# EAGLE design jumper_bed_M (EAGLE 9.6.2)
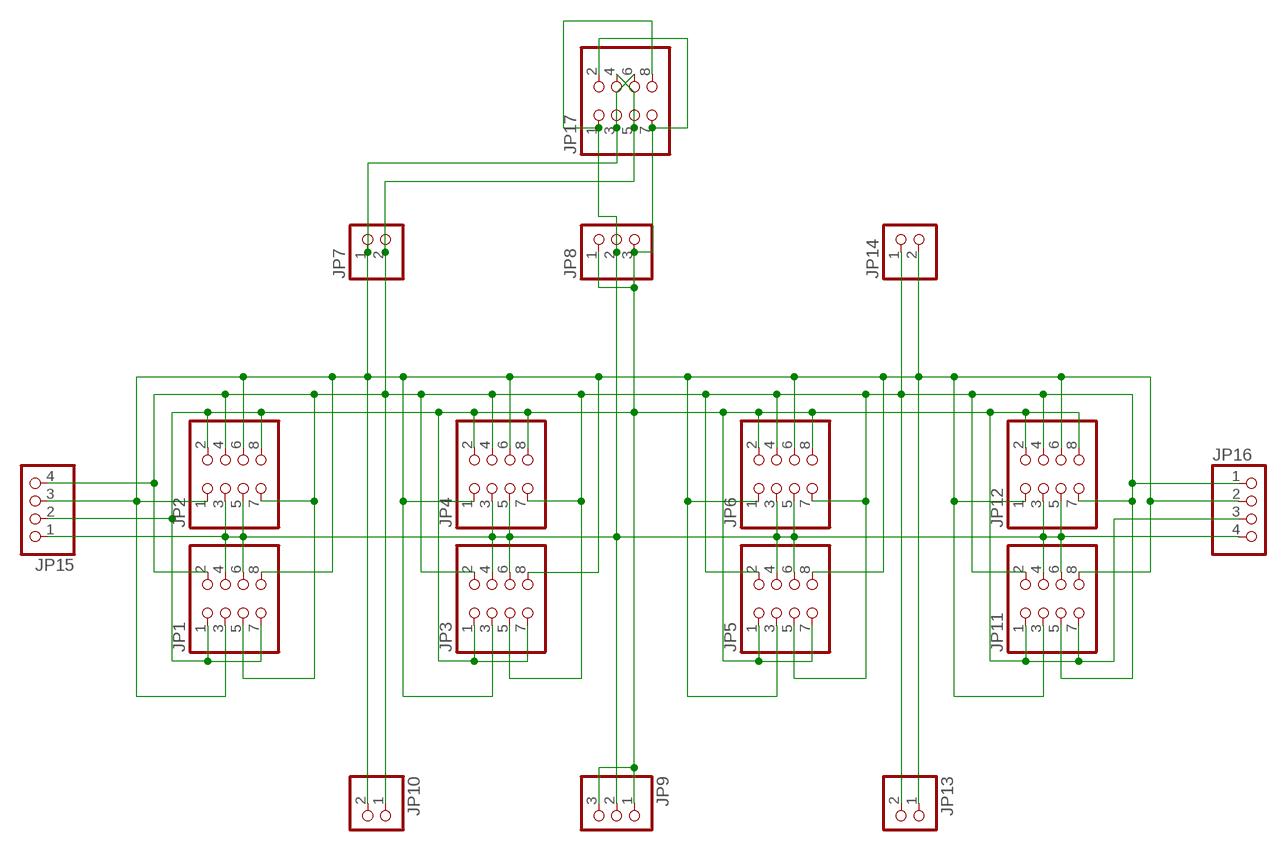
[diagram p0: schematic, sheet 1]

## Parts
JP1  PINHD-2X4  [2X04]
JP2  PINHD-2X4  [2X04]
JP3  PINHD-2X4  [2X04]
JP4  PINHD-2X4  [2X04]
JP5  PINHD-2X4  [2X04]
JP6  PINHD-2X4  [2X04]
JP7  PINHD-1X2/90  [1X02/90]
JP8  PINHD-1X3/90  [1X03/90]
JP9  PINHD-1X31X03/90F  [1X03/90F]
JP10  PINHD-1X21X02/90F  [1X02/90F]
JP11  PINHD-2X4  [2X04]
JP12  PINHD-2X4  [2X04]
JP13  PINHD-1X21X02/90F  [1X02/90F]
JP14  PINHD-1X2/90  [1X02/90]
JP15  PINHD-1X4  [1X04]
JP16  PINHD-1X4  [1X04]
JP17  PINHD-2X4/90  [2X04/90]

## Nets
GND: JP1.1 JP1.7 JP2.2 JP2.8 JP3.1 JP3.7 JP4.2 JP4.8 JP5.1 JP5.7 JP6.2 JP6.8 JP8.1 JP8.3 JP9.1 JP9.3 JP11.1 JP11.7 JP12.2 JP12.8 JP15.2 JP16.3 JP17.2 JP17.7
SCL: JP1.2 JP1.5 JP2.4 JP2.7 JP3.2 JP3.5 JP4.4 JP4.7 JP5.2 JP5.5 JP6.4 JP6.7 JP7.2 JP10.1 JP11.2 JP11.5 JP12.4 JP12.7 JP13.2 JP14.1 JP15.4 JP16.1 JP17.4 JP17.5
SDA: JP1.3 JP1.8 JP2.1 JP2.6 JP3.3 JP3.8 JP4.1 JP4.6 JP5.3 JP5.8 JP6.1 JP6.6 JP7.1 JP10.2 JP11.3 JP11.8 JP12.1 JP12.6 JP13.1 JP14.2 JP15.3 JP16.2 JP17.3 JP17.6
VCC: JP1.4 JP1.6 JP2.3 JP2.5 JP3.4 JP3.6 JP4.3 JP4.5 JP5.4 JP5.6 JP6.3 JP6.5 JP8.2 JP9.2 JP11.4 JP11.6 JP12.3 JP12.5 JP15.1 JP16.4 JP17.1 JP17.8

## Library data of the parts
JP1-JP6 JP11 JP12 JP17 = pinhead2:PINHD-2X4: PIN HEADER
JP7 JP10 JP13 JP14 = pinhead2:PINHD-1X2: PIN HEADER
JP8 JP9 = pinhead2:PINHD-1X3: PIN HEADER
JP15 JP16 = pinhead2:PINHD-1X4: PIN HEADER

## Board
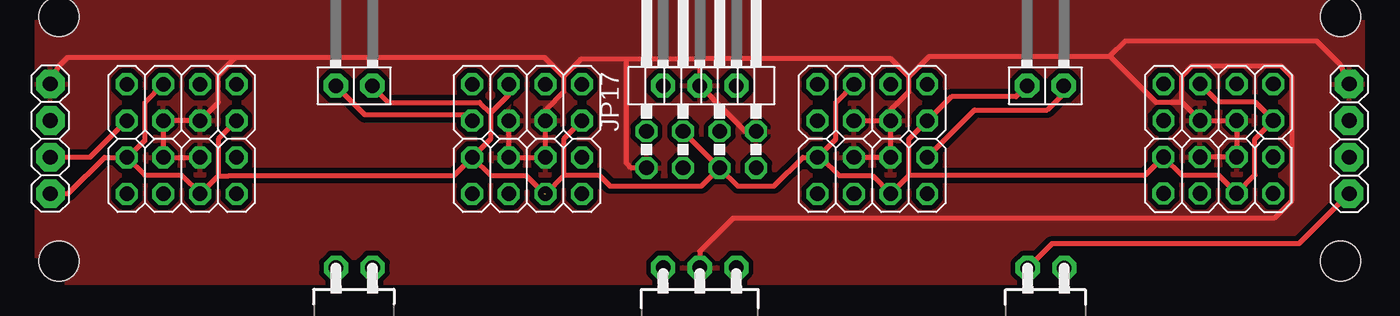
[diagram p1: board, top side]
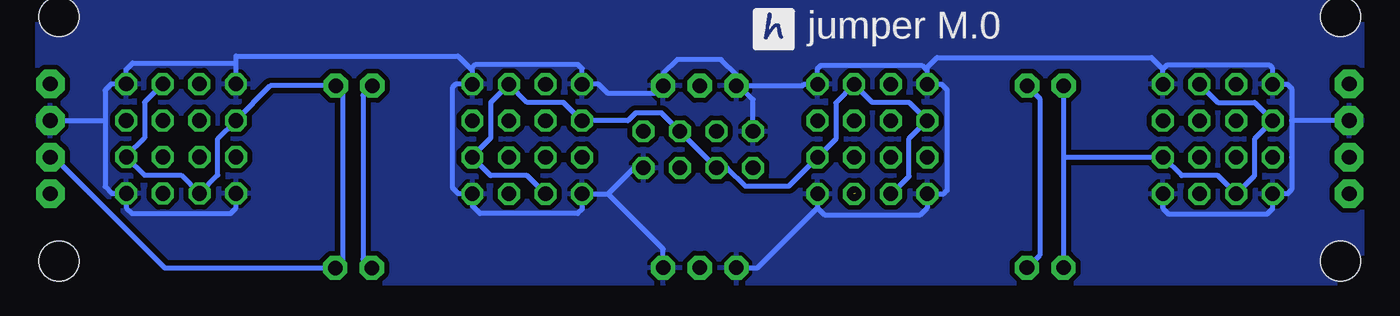
[diagram p2: board, bottom side, seen from below]

No outline drawn. Coordinates in mm, seen from the top.
Copper layers (1*16): Top 0.035mm / dielectric 1.5mm / Bottom 0.035mm
Design rules "default *": minimum track width 14mil, minimum drill 0.35mm, track to track 14mil, track to pad 13mil, pad to pad 14mil, via to via 14mil, smd to smd 14mil, copper to edge 0mil, drill to drill 15mil, minimum pad ring 10mil, minimum via ring 8mil, stop-mask expansion 4mil, vias tented up to drill 0mil, thermal gap 10mil
Holes 2.8 mm at 91,2 91,19 2,19 2,2

### Footprints (pad centres in the part's own frame; a part is rotated, then mirrored left to right if it is on the bottom)
2X04 = drill 1.016 octagon: 1 -3.81,-1.27; 2 -3.81,1.27; 3 -1.27,-1.27; 4 -1.27,1.27; 5 1.27,-1.27; 6 1.27,1.27; 7 3.81,-1.27; 8 3.81,1.27
1X02/90 = drill 1.016 pad 1.676 octagon: 1 -1.27,-3.81; 2 1.27,-3.81
1X03/90 = drill 1.016 pad 1.676 octagon: 1 -2.54,-3.81; 2 0,-3.81; 3 2.54,-3.81
1X03/90F = drill 1.016 pad 1.676 octagon: 1 -2.54,0; 2 0,0; 3 2.54,0
1X02/90F = drill 1.016 pad 1.676 octagon: 1 -1.31,0; 2 1.23,0
1X04 = drill 1.016 pad 1.981 octagon: 1 -3.81,0; 2 -1.27,0; 3 1.27,0; 4 3.81,0
2X04/90 = drill 1.016 octagon: 1 -3.81,-6.35; 2 -3.81,-3.81; 3 -1.27,-6.35; 4 -1.27,-3.81; 5 1.27,-6.35; 6 1.27,-3.81; 7 3.81,-6.35; 8 3.81,-3.81

### Placement (x,y rotation side)
JP1  10.52,13.03 180 top
JP2  10.52,7.95 180 top
JP3  34.51,13.03 180 top
JP4  34.51,7.95 180 top
JP5  58.48,13.03 180 top
JP6  58.48,7.95 180 top
JP7  22.5,18 0 top
JP8  46.5,18 0 top
JP9  46.5,1.54 180 top
JP10  22.47,1.54 180 top
JP11  82.51,7.97 0 top
JP12  82.52,13.05 0 top
JP13  70.5,1.52 180 top
JP14  70.5,18 0 top
JP15  1.4,10.5 270 top
JP16  91.6,10.5 90 top
JP17  46.61,14.83 0 top

### Tracks (layer width: path | path; a pad name or v marks a point on that pad's centre or on a via)
GND
  Bottom 0.356: JP5.7 54.67,15.39 54.98,15.69 62.06,15.69 62.39,15.36 | JP5.7 54.67,14.88 | JP3.7 30.7,15.24 30.81,15.35 | 30.81,15.35 31.08,15.62 38.09,15.62 38.32,15.39 JP3.1 39.26,14.3 39.37,14.19 JP8.1 43.96,14.4 | JP3.7 29.71,14.3 29.33,13.91 29.33,6.91 29.56,6.68 JP4.8 30.7,5.71 31.18,5.23 37.84,5.23 38.32,5.71 | JP1.1 14.33,15.35 | 14.33,15.35 14.07,15.62 6.92,15.62 6.71,15.41 JP1.7 5.7,14.3 5.41,14 5.41,11.79 | 14.35,5.76 14.33,5.8 JP2.2 14.33,5.67 13.91,5.25 7.11,5.25 6.71,5.65 JP2.8 5.7,6.68 5.41,6.97 5.41,9.22 | 5.41,11.79 5.41,9.22 | JP4.2 38.32,5.71 | JP6.8 54.67,5.61 54.98,5.3 61.76,5.3 62.29,5.84 JP6.2 63.26,6.68 63.66,7.08 63.66,14.09 63.46,14.3 JP5.1 62.29,15.26 62.39,15.36 | JP6.8 54.67,6.04 | JP3.7 30.7,15.31 | 30.81,15.35 30.02,16.15 15.13,16.15 14.33,15.35 | JP12.2 78.71,15.76 | 78.71,15.76 78.71,16.26 63.29,16.26 62.39,15.36 | 87.8,11.68 87.8,13.88 87.36,14.31 JP12.8 86.33,15.31 85.88,15.76 78.71,15.76 | 87.8,11.68 87.8,7.18 87.32,6.7 JP11.7 86.32,5.7 85.93,5.31 79.09,5.31 78.7,5.7 JP11.1 | JP5.7 53.53,14.3 52.92,13.69 49.54,13.69 JP8.3 49.04,15.03 48.06,16.01 45.01,16.01 43.96,14.96 43.96,14.4 | JP9.3 42.49,1.54 38.32,5.71 | JP9.1 49.04,2.85 52.87,6.68 | JP6.8 52.87,6.68 | 5.4,9.23 5.41,9.22 | JP15.2 5.39,11.77 5.41,11.79 | JP16.3 87.89,11.77 87.8,11.68 | 52.87,6.68 51.06,8.48 JP17.7 | JP17.2 42.8,13.24 43.96,14.4
  pour Bottom: 92.5,0.5 0.5,0.5 0.5,20.5 92.5,20.5
SCL  (1 unrouted)
  Top 0.356: 35.7,6.71 35.65,6.73 34.43,7.95 31.99,7.95 30.72,9.22 JP4.7 | 30.65,9.22 JP4.7 | JP4.7 30.7,9.16 | JP6.7 55.94,10.49 55.94,13.04 JP5.5 | 61.02,7.95 JP6.4 58.48,7.95 56.19,7.95 54.91,9.22 JP6.7 | 62.29,11.74 JP5.2 | 61.02,7.95 61.02,10.47 62.29,11.74 | JP12.4 82.52,13.04 85.08,13.04 85.86,12.26 85.86,12.24 JP12.7 85.05,10.5 85.05,7.97 JP11.5 83.78,6.72 82.53,7.97 79.97,7.97 JP11.2 77.4,7.95 61.02,7.95 | JP1.2 13.06,10.49 13.06,7.93 | 13.06,7.93 11.81,6.68 JP2.4 11.79,6.69 10.54,7.95 7.98,7.95 JP2.7 | JP1.5 7.98,13.03 7.98,10.42 6.78,9.22 JP2.7 | JP3.2 37.05,10.49 37.05,7.95 | JP3.5 33.24,13.55 31.97,12.28 | JP4.7 31.97,10.49 31.97,12.28 | 13.06,7.93 13.79,7.93 13.81,7.95 29.43,7.95 JP4.7 | JP7.2 23.77,14.16 24.91,13.03 31.23,13.03 31.97,12.28 | 37.05,7.95 JP4.4 | JP6.7 53.66,9.22 51.65,7.21 49.15,7.21 JP17.5 | JP14.1 68.47,13.43 63.98,13.43 62.29,11.74 | JP13.2 70.95,3.2 88.11,3.2 JP16.1 | JP15.4 2.65,6.69 5.18,9.22 JP2.7 | JP17.4 JP17.5 | 37.05,7.95 39.53,7.95 40.27,7.21 46.61,7.21 JP17.5
  Bottom 0.356: JP10.1 23.76,1.54 22.89,2.4 22.89,13.31 JP7.2 | JP13.2 69.88,2.13 69.88,13.54 JP14.1
SDA
  Top 0.356: JP14.2 71.77,13.65 70.63,12.51 65.59,12.51 JP6.1 | JP3.8 30.29,12.16 23.26,12.16 JP7.1 | 38.47,9.06 JP4.1 | JP15.3 4.19,9.23 JP1.8
  Bottom 0.356: 9.28,6.68 JP2.6 | JP4.6 33.19,6.68 31.97,7.89 31.97,10.51 30.72,11.76 JP3.8 30.7,11.77 31.95,13.03 34.51,13.03 JP3.3 35.78,14.29 37.05,13.02 37.05,10.49 JP4.1 40.32,7.21 43.33,7.21 44.59,8.48 JP17.3 JP17.6 49.15,12.29 50.95,12.29 51.48,11.76 JP5.8 54.7,11.76 55.97,13.03 58.48,13.03 JP5.3 61.02,13.03 61.02,10.57 62.29,9.3 JP6.1 61.02,7.95 58.48,7.95 JP6.6 | JP12.6 85.06,13.04 85.06,10.56 86.32,9.3 JP11.8 85.05,7.97 82.52,7.97 JP11.3 79.97,7.97 79.97,10.52 JP12.1 78.71,11.8 76.32,14.19 JP14.2 71.3,13.72 71.3,2.03 JP13.1 83.65,1.52 91,8.87 JP16.2 | JP1.3 10.52,13.03 7.97,13.03 6.71,11.77 JP1.8 7.98,10.49 7.98,7.93 9.24,6.68 JP2.6 | JP2.6 10.52,7.95 13.03,7.95 14.3,9.22 JP2.1 21.12,9.22 21.24,9.09 | JP7.1 21.24,14.18 21.24,9.09 | 21.24,9.09 JP10.2
VCC
  Top 0.356: JP2.5 JP1.6 JP1.4 13.06,13.03 13.06,14.96 14.28,16.18 | JP2.5 | JP2.5 JP2.3 | JP5.6 JP5.4 | JP5.4 JP6.3 JP6.5 | JP3.6 JP4.5 JP4.3 JP3.4 35.78,12.5 37.05,13.77 37.05,14.82 36.94,14.94 | JP11.4 JP11.6 JP12.5 JP12.3 79.98,13.04 | 79.98,13.04 78.18,13.04 74.98,16.24 | JP5.4 59.75,12.5 61.02,13.77 61.02,14.82 | 14.28,16.18 35.69,16.18 36.94,14.94 | 36.94,14.94 37.16,14.94 38.29,16.07 41.4,16.07 | 61.02,14.82 59.78,16.07 46.53,16.07 | 41.4,16.07 46.53,16.07 | 61.02,14.82 62.44,16.24 74.98,16.24 | 46.53,16.07 46.5,16.03 JP8.2 48.4,12.29 48.41,12.29 49.67,11.02 JP17.8 | 79.98,13.04 79.98,14.84 80.72,15.59 86.85,15.59 87.6,14.84 87.6,6.18 86.39,4.98 48.79,4.98 46.5,2.69 JP9.2 | JP15.1 2,15.55 2.62,16.18 14.28,16.18 | JP16.4 91,15.63 89.33,17.3 76.04,17.3 74.98,16.24 | JP17.1 41.73,8.48 41.4,8.81 41.4,16.07
  pour Top: 0.5,20.5 92.5,20.5 92.5,0.5 0.5,0.5

### Text on the board
bPlace: jumper M.0